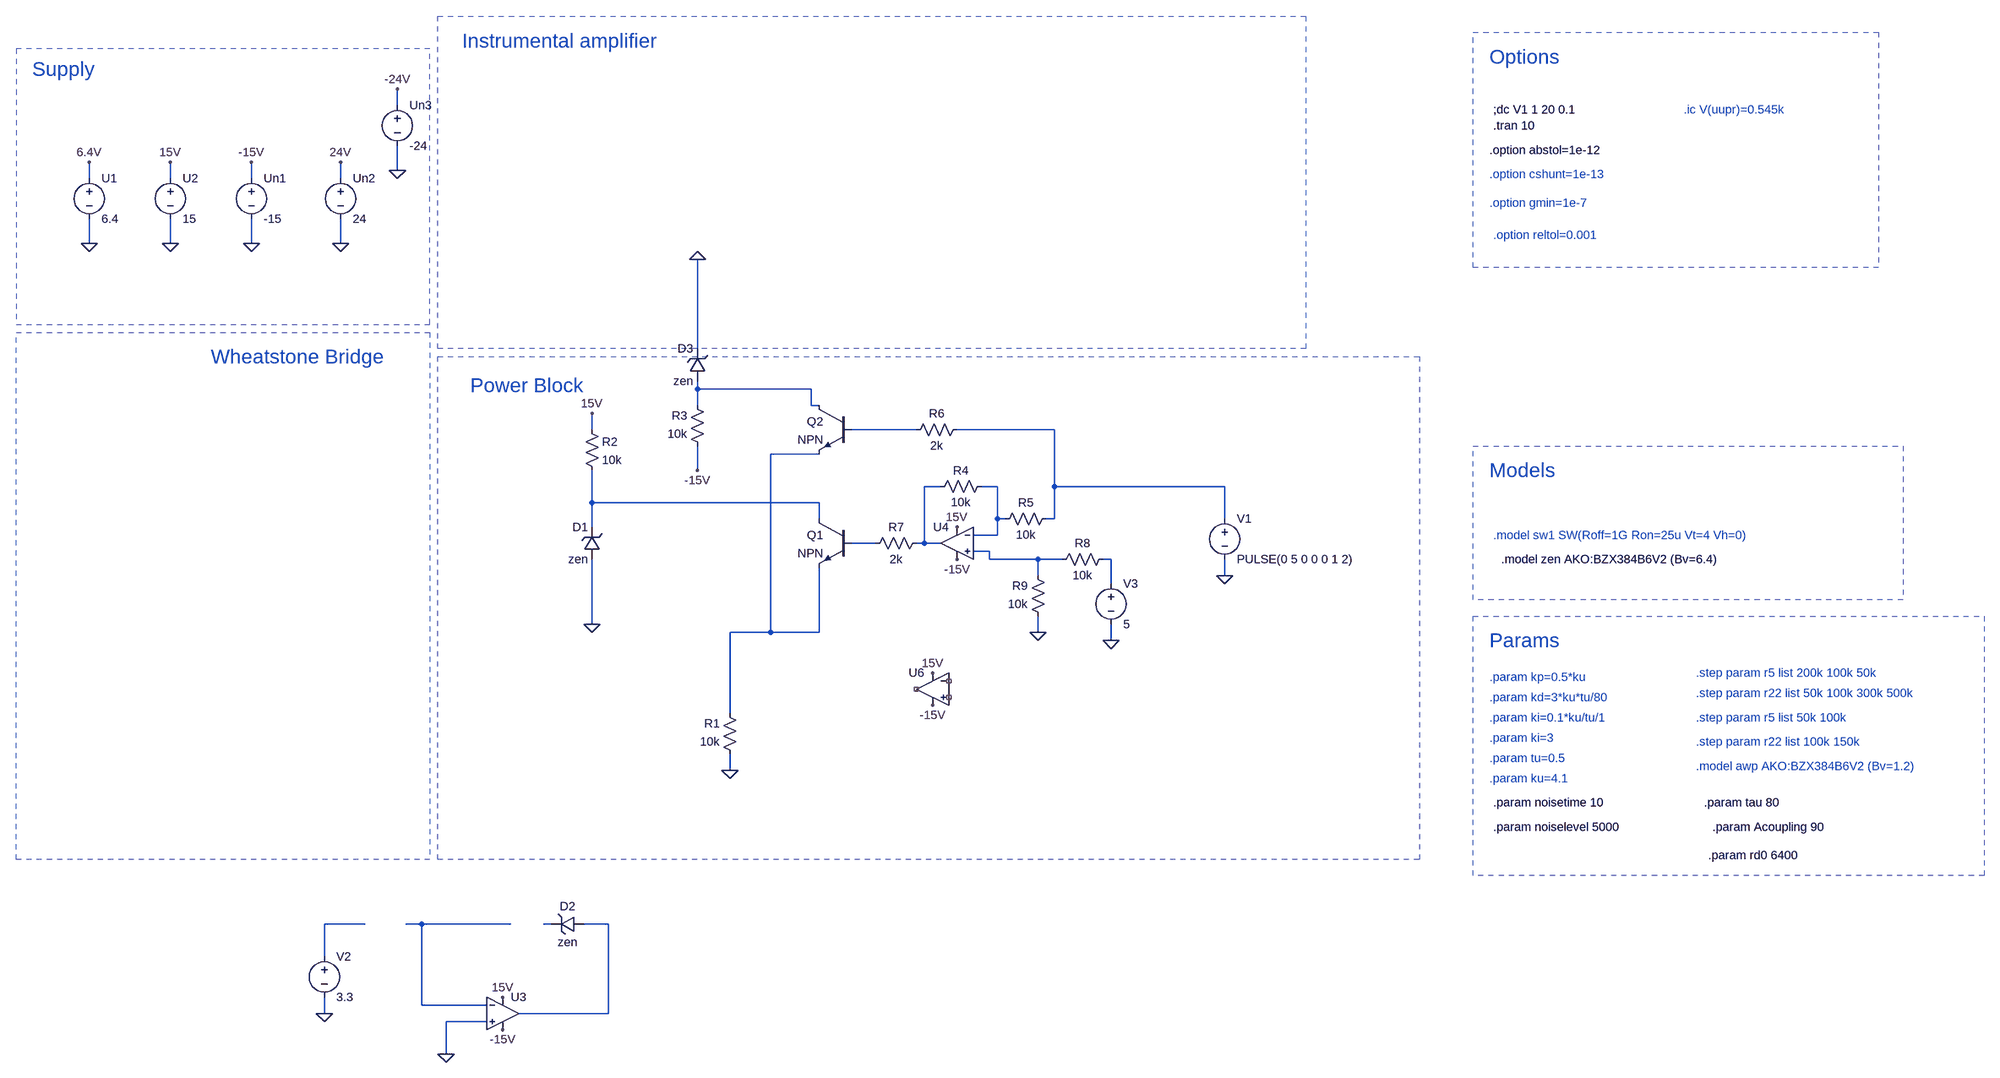
[diagram p0: schematic Draft1.asc]
Draft1.asc, the LTspice schematic file:
Version 4
SHEET 1 1540 1236
WIRE -1776 -2480 -1776 -2512
WIRE -1776 -2352 -1776 -2400
WIRE -2384 -2336 -2384 -2368
WIRE -2224 -2336 -2224 -2368
WIRE -2064 -2336 -2064 -2368
WIRE -1888 -2336 -1888 -2368
WIRE -2384 -2208 -2384 -2256
WIRE -2224 -2208 -2224 -2256
WIRE -2064 -2208 -2064 -2256
WIRE -1888 -2208 -1888 -2256
WIRE -1184 -2000 -1184 -2176
WIRE -1184 -1920 -1184 -1936
WIRE -960 -1920 -1184 -1920
WIRE -1184 -1888 -1184 -1920
WIRE -960 -1888 -960 -1920
WIRE -944 -1888 -960 -1888
WIRE -1392 -1840 -1392 -1872
WIRE -752 -1840 -880 -1840
WIRE -480 -1840 -672 -1840
WIRE -944 -1792 -1040 -1792
WIRE -1184 -1760 -1184 -1808
WIRE -704 -1728 -736 -1728
WIRE -592 -1728 -624 -1728
WIRE -480 -1728 -480 -1840
WIRE -144 -1728 -480 -1728
WIRE -1392 -1696 -1392 -1760
WIRE -944 -1696 -1392 -1696
WIRE -944 -1664 -944 -1696
WIRE -592 -1664 -592 -1728
WIRE -576 -1664 -592 -1664
WIRE -480 -1664 -480 -1728
WIRE -480 -1664 -496 -1664
WIRE -144 -1664 -144 -1728
WIRE -1392 -1648 -1392 -1696
WIRE -592 -1632 -592 -1664
WIRE -592 -1632 -640 -1632
WIRE -832 -1616 -880 -1616
WIRE -736 -1616 -736 -1728
WIRE -736 -1616 -752 -1616
WIRE -704 -1616 -736 -1616
WIRE -608 -1600 -640 -1600
WIRE -608 -1584 -608 -1600
WIRE -512 -1584 -608 -1584
WIRE -464 -1584 -512 -1584
WIRE -368 -1584 -384 -1584
WIRE -512 -1552 -512 -1584
WIRE -144 -1552 -144 -1584
WIRE -368 -1536 -368 -1584
WIRE -1392 -1456 -1392 -1584
WIRE -1040 -1440 -1040 -1792
WIRE -1040 -1440 -1120 -1440
WIRE -944 -1440 -944 -1568
WIRE -944 -1440 -1040 -1440
WIRE -512 -1440 -512 -1472
WIRE -368 -1424 -368 -1456
WIRE -1120 -1280 -1120 -1440
WIRE -1120 -1168 -1120 -1200
WIRE -1840 -864 -1920 -864
WIRE -1728 -864 -1760 -864
WIRE -1552 -864 -1728 -864
WIRE -1472 -864 -1488 -864
WIRE -1360 -864 -1408 -864
WIRE -1920 -800 -1920 -864
WIRE -1728 -704 -1728 -864
WIRE -1600 -704 -1728 -704
WIRE -1920 -688 -1920 -720
WIRE -1360 -688 -1360 -864
WIRE -1360 -688 -1536 -688
WIRE -1600 -672 -1680 -672
WIRE -1680 -608 -1680 -672
FLAG -2384 -2208 0
FLAG -2384 -2368 6.4V
FLAG -2224 -2208 0
FLAG -2224 -2368 15V
FLAG -2064 -2208 0
FLAG -2064 -2368 -15V
FLAG -1888 -2208 0
FLAG -1888 -2368 24V
FLAG -720 -1296 -15V
FLAG -720 -1360 15V
FLAG -1776 -2352 0
FLAG -1776 -2512 -24V
FLAG -144 -1552 0
FLAG -1568 -720 15V
FLAG -1568 -656 -15V
FLAG -1920 -688 0
FLAG -1680 -608 0
FLAG -672 -1584 -15V
FLAG -672 -1648 15V
FLAG -1392 -1872 15V
FLAG -1392 -1456 0
FLAG -1184 -1760 -15V
FLAG -1184 -2176 0
FLAG -368 -1424 0
FLAG -512 -1440 0
FLAG -1120 -1168 0
SYMBOL voltage -2384 -2352 R0
WINDOW 123 0 0 Left 0
WINDOW 39 0 0 Left 0
SYMATTR InstName U1
SYMATTR Value 6.4
SYMBOL voltage -2224 -2352 R0
WINDOW 123 0 0 Left 0
WINDOW 39 0 0 Left 0
SYMATTR InstName U2
SYMATTR Value 15
SYMBOL voltage -2064 -2352 R0
WINDOW 123 0 0 Left 0
WINDOW 39 0 0 Left 0
SYMATTR InstName Un1
SYMATTR Value -15
SYMBOL voltage -1888 -2352 R0
WINDOW 123 0 0 Left 0
WINDOW 39 0 0 Left 0
SYMATTR InstName Un2
SYMATTR Value 24
SYMBOL Opamps\\UniversalOpamp2 -720 -1328 M0
SYMATTR InstName U6
SYMATTR Value2 Avol=250k GBW=10Meg Slew=10Meg
SYMBOL voltage -1776 -2496 R0
WINDOW 123 0 0 Left 0
WINDOW 39 0 0 Left 0
SYMATTR InstName Un3
SYMATTR Value -24
SYMBOL res -1104 -1184 R180
WINDOW 0 36 76 Left 2
WINDOW 3 36 40 Left 2
SYMATTR InstName R1
SYMATTR Value 10k
SYMBOL voltage -144 -1680 R0
WINDOW 123 0 0 Left 0
WINDOW 39 0 0 Left 0
SYMATTR InstName V1
SYMATTR Value PULSE(0 5 0 0 0 1 2)
SYMBOL Opamps\\UniversalOpamp2 -1568 -688 R0
SYMATTR InstName U3
SYMATTR Value2 Avol=250k GBW=10Meg Slew=10Meg
SYMBOL voltage -1920 -816 R0
WINDOW 123 0 0 Left 0
WINDOW 39 0 0 Left 0
SYMATTR InstName V2
SYMATTR Value 3.3
SYMBOL zener -1408 -880 R90
WINDOW 0 -4 32 VBottom 2
WINDOW 3 36 32 VTop 2
SYMATTR InstName D2
SYMATTR Value zen
SYMBOL zener -1376 -1584 R180
WINDOW 0 24 64 Left 2
WINDOW 3 24 0 Left 2
SYMATTR InstName D1
SYMATTR Value zen
SYMBOL Opamps\\UniversalOpamp2 -672 -1616 M0
SYMATTR InstName U4
SYMATTR Value2 Avol=250k GBW=10Meg Slew=10Meg
SYMBOL res -1408 -1856 R0
SYMATTR InstName R2
SYMATTR Value 10k
SYMBOL zener -1168 -1936 R180
WINDOW 0 24 64 Left 2
WINDOW 3 24 0 Left 2
SYMATTR InstName D3
SYMATTR Value zen
SYMBOL res -1168 -1792 R180
WINDOW 0 36 76 Left 2
WINDOW 3 36 40 Left 2
SYMATTR InstName R3
SYMATTR Value 10k
SYMBOL npn -880 -1664 M0
SYMATTR InstName Q1
SYMBOL npn -880 -1888 M0
SYMATTR InstName Q2
SYMBOL res -608 -1744 R90
WINDOW 0 0 56 VBottom 2
WINDOW 3 32 56 VTop 2
SYMATTR InstName R4
SYMATTR Value 10k
SYMBOL res -480 -1680 R90
WINDOW 0 0 56 VBottom 2
WINDOW 3 32 56 VTop 2
SYMATTR InstName R5
SYMATTR Value 10k
SYMBOL res -656 -1856 R90
WINDOW 0 0 56 VBottom 2
WINDOW 3 32 56 VTop 2
SYMATTR InstName R6
SYMATTR Value 2k
SYMBOL res -736 -1632 R90
WINDOW 0 0 56 VBottom 2
WINDOW 3 32 56 VTop 2
SYMATTR InstName R7
SYMATTR Value 2k
SYMBOL voltage -368 -1552 R0
WINDOW 123 0 0 Left 0
WINDOW 39 0 0 Left 0
SYMATTR InstName V3
SYMATTR Value 5
SYMBOL res -368 -1600 R90
WINDOW 0 0 56 VBottom 2
WINDOW 3 32 56 VTop 2
SYMATTR InstName R8
SYMATTR Value 10k
SYMBOL res -496 -1456 R180
WINDOW 0 36 76 Left 2
WINDOW 3 36 40 Left 2
SYMATTR InstName R9
SYMATTR Value 10k
TEXT 568 -2440 Left 2 !.tran 10
TEXT -2144 -1984 Left 4 ;Wheatstone Bridge
TEXT -2496 -2552 Left 4 ;Supply
TEXT -1632 -1928 Left 4 ;Power Block
TEXT 568 -1632 Left 2 ;.model sw1 SW(Roff=1G Ron=25u Vt=4 Vh=0)
TEXT 560 -1352 Left 2 ;.param kp=0.5*ku
TEXT 560 -1312 Left 2 ;.param kd=3*ku*tu/80
TEXT 560 -1272 Left 2 ;.param ki=0.1*ku/tu/1
TEXT 560 -1192 Left 2 ;.param tu=0.5
TEXT 560 -1152 Left 2 ;.param ku=4.1
TEXT 560 -1232 Left 2 ;.param ki=3
TEXT 944 -2472 Left 2 ;.ic V(uupr)=0.545k
TEXT 584 -1584 Left 2 !.model zen AKO:BZX384B6V2 (Bv=6.4)
TEXT 568 -2472 Left 2 !;dc V1 1 20 0.1
TEXT 560 -2392 Left 2 !.option abstol=1e-12
TEXT 560 -2344 Left 2 ;.option cshunt=1e-13
TEXT 560 -2288 Left 2 ;.option gmin=1e-7
TEXT 568 -2224 Left 2 ;.option reltol=0.001
TEXT 968 -1176 Left 2 ;.model awp AKO:BZX384B6V2 (Bv=1.2)
TEXT 968 -1360 Left 2 ;.step param r5 list 200k 100k 50k
TEXT 968 -1320 Left 2 ;.step param r22 list 50k 100k 300k 500k
TEXT 968 -1224 Left 2 ;.step param r22 list 100k 150k
TEXT 968 -1272 Left 2 ;.step param r5 list 50k 100k
TEXT -1648 -2608 Left 4 ;Instrumental amplifier
TEXT 560 -2576 Left 4 ;Options
TEXT 560 -1760 Left 4 ;Models
TEXT 560 -1424 Left 4 ;Params
TEXT 568 -1104 Left 2 !.param noisetime 10
TEXT 568 -1056 Left 2 !.param noiselevel 5000
TEXT 984 -1104 Left 2 !.param tau 80
TEXT 1000 -1056 Left 2 !.param Acoupling 90
TEXT 992 -1000 Left 2 !.param rd0 6400
RECTANGLE Normal -1712 -992 -2528 -2032 2
RECTANGLE Normal -1712 -2592 -2528 -2048 2
RECTANGLE Normal 16 -2000 -1696 -2656 2
RECTANGLE Normal 240 -992 -1696 -1984 2
RECTANGLE Normal 1328 -2160 528 -2624 2
RECTANGLE Normal 1376 -1504 528 -1808 2
RECTANGLE Normal 1536 -960 528 -1472 2

The netlist it stands for:
* Draft1.asc
V§U1 6.4V 0 6.4
V§U2 15V 0 15
V§Un1 -15V 0 -15
V§Un2 24V 0 24
XU6 NC_01 NC_02 15V -15V NC_03 level.2 Avol=250k GBW=10Meg Slew=10Meg ilimit=25m rail=0 Vos=0 phimargin=45 en=0 enk=0 in=0 ink=0 Rin=500Meg  ; pins IN+ IN- V+ V- OUT
V§Un3 -24V 0 -24
R1 0 N004 10k
V1 N003 0 PULSE(0 5 0 0 0 1 2)
XU3 0 N012 15V -15V N014 level.2 Avol=250k GBW=10Meg Slew=10Meg ilimit=25m rail=0 Vos=0 phimargin=45 en=0 enk=0 in=0 ink=0 Rin=500Meg  ; pins IN+ IN- V+ V- OUT
V2 N011 0 3.3
D2 N014 N013 zen
D1 0 N007 zen
XU4 N009 N006 15V -15V N005 level.2 Avol=250k GBW=10Meg Slew=10Meg ilimit=25m rail=0 Vos=0 phimargin=45 en=0 enk=0 in=0 ink=0 Rin=500Meg  ; pins IN+ IN- V+ V- OUT
R2 15V N007 10k
D3 N001 0 zen
R3 -15V N001 10k
Q1 N007 N008 N004 0 NPN
Q2 N001 N002 N004 0 NPN
R4 N006 N005 10k
R5 N003 N006 10k
R6 N003 N002 2k
R7 N005 N008 2k
V3 N010 0 5
R8 N010 N009 10k
R9 0 N009 10k
.model D D
.lib standard.dio
.model NPN NPN
.model PNP PNP
.lib standard.bjt
.tran 10
* Wheatstone Bridge
* Supply
* Power Block
* .model sw1 SW(Roff=1G Ron=25u Vt=4 Vh=0)
* .param kp=0.5*ku
* .param kd=3*ku*tu/80
* .param ki=0.1*ku/tu/1
* .param tu=0.5
* .param ku=4.1
* .param ki=3
* .ic V(uupr)=0.545k
.model zen AKO:BZX384B6V2 (Bv=6.4)
;dc V1 1 20 0.1
.option abstol=1e-12
* .option cshunt=1e-13
* .option gmin=1e-7
* .option reltol=0.001
* .model awp AKO:BZX384B6V2 (Bv=1.2)
* .step param r5 list 200k 100k 50k
* .step param r22 list 50k 100k 300k 500k
* .step param r22 list 100k 150k
* .step param r5 list 50k 100k
* Instrumental amplifier
* Options
* Models
* Params
.param noisetime 10
.param noiselevel 5000
.param tau 80
.param Acoupling 90
.param rd0 6400
.lib UniversalOpamps2.sub
.backanno
.end